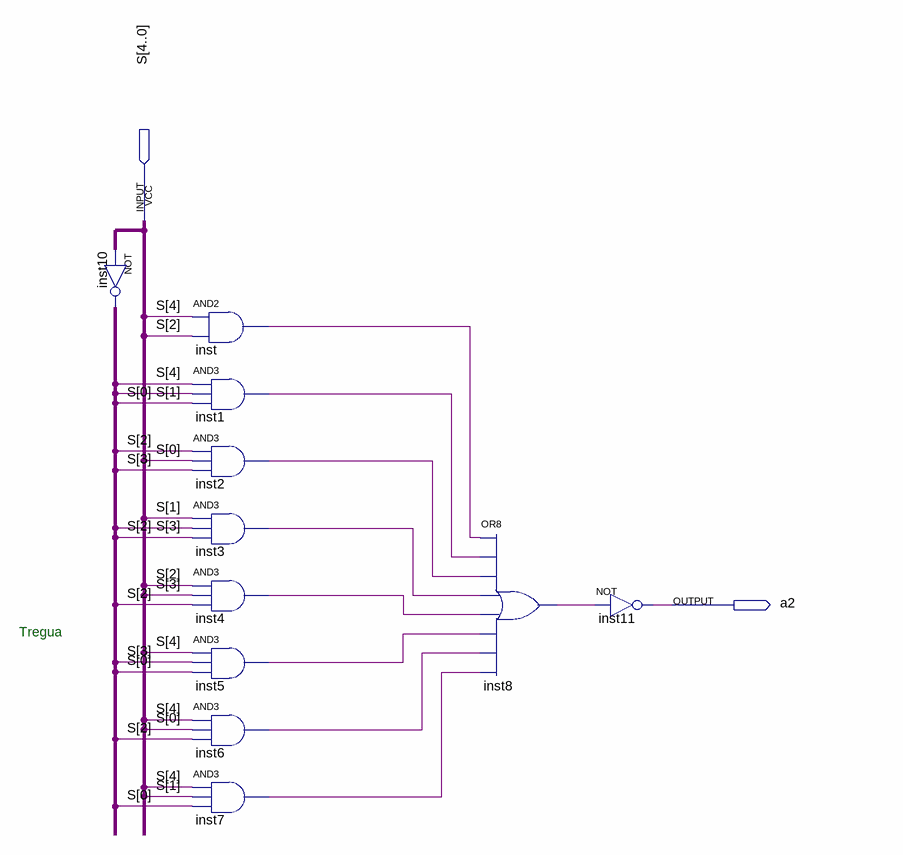
[diagram p0: schematic sheet]
// Quartus schematic b2D.bdf as structural Verilog: 11 symbols, 2 pins
module b2D (
  input  [4:0] S,
  output a2
);

  wire inst1_out, inst2_out, inst3_out, inst4_out, inst5_out, inst6_out, inst7_out, inst8_out, inst_out;
  wire [4:0] inst10_out;

  assign inst10_out = ~S;  // NOT inst10, 5 bits wide
  and inst (inst_out, S[4], S[2]);
  and inst1 (inst1_out, S[4], S[1], S[0]);
  and inst2 (inst2_out, S[2], S[0], S[3]);
  and inst3 (inst3_out, S[1], S[3], S[2]);
  and inst4 (inst4_out, S[2], S[3], S[2]);
  and inst5 (inst5_out, S[4], S[3], S[0]);
  and inst6 (inst6_out, S[4], S[0], S[2]);
  and inst7 (inst7_out, S[4], S[1], S[0]);
  or inst8 (inst8_out, inst_out, inst1_out, inst2_out, inst3_out, inst4_out, inst5_out, inst6_out, inst7_out);
  not inst11 (a2, inst8_out);

  // Notes on the sheet:
  //   Tregua
endmodule
